# EAGLE design LT1054_Bipolar5V (EAGLE 9.6.2)
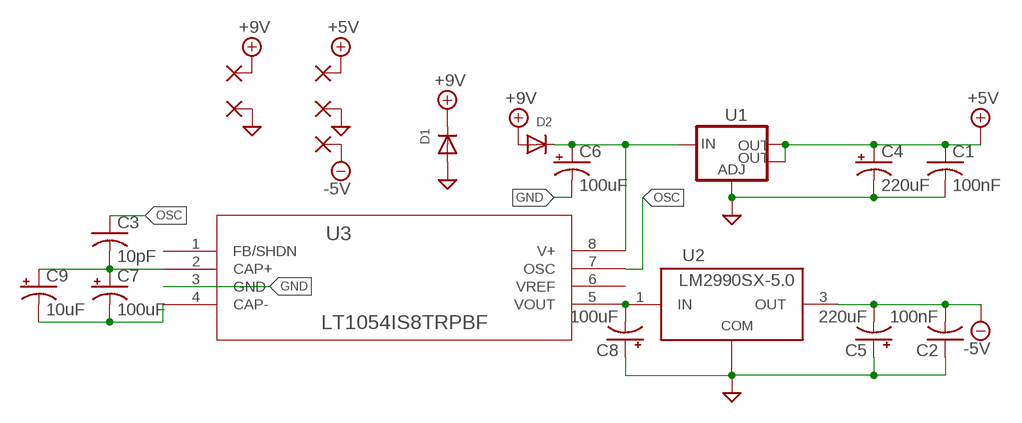
[diagram p0: schematic, sheet 1]

## Parts
C1  100nF  C-USC0603  [C0603]
C2  100nF  C-USC0603  [C0603]
C3  10pF  C-USC0603  [C0603]
C4  220uF  CPOL-USE  [PANASONIC_E]
C5  220uF  CPOL-USE  [PANASONIC_E]
C6  100uF  CPOL-USD  [PANASONIC_D]
C7  100uF  CPOL-USD  [PANASONIC_D]
C8  100uF  CPOL-USD  [PANASONIC_D]
C9  10uF  CPOL-USB  [PANASONIC_B]
D1  DIODESOD-123  [SOD-123]
D2  DIODESOD-123  [SOD-123]
PAD1  SMD2  [SMD1,27-2,54]
PAD2  1,6/0,8  [1,6/0,8]
PAD3  1,6/0,8  [1,6/0,8]
PAD4  1,6/0,8  [1,6/0,8]
PAD5  1,6/0,8  [1,6/0,8]
U1  V_REG_LM1117SOT223  [SOT223]
U2  LM2990SX-5.0  UA7805CKTTR  [D2PAK-3]
U3  LT1054IS8TRPBF  [SO-8_S]

## Nets
+5V: C1.1 C4.+ PAD3.1(P) U1.2(OUT) U1.4(OUT)
+9V: D1.C D2.A PAD1.1(P)
-5V: C2.2 C5.- PAD5.1(P) U2.3(OUT)
GND: C1.2 C2.1 C4.- C5.+ C6.- C8.+ D1.A PAD2.1(P) PAD4.1(P) U1.1(ADJ) U2.2(COM) U2.4(COM) U3.3(GND)
N$1: C6.+ D2.C U1.3(IN) U3.8(V+)
N$2: C8.- U2.1(IN) U3.5(VOUT)
N$3: C3.2 C7.+ C9.+ U3.2(CAP+)
N$4: C7.- C9.- U3.4(CAP-)
OSC: C3.1 U3.7(OSC)
Unconnected: U3.1(FB/SHDN)

## Power pins joined to a net without a drawn wire
VREF: U3.6(VREF)

## Library data of the parts
C1-C3 = adafruit:C-US: CAPACITOR, American symbol
C4-C9 = adafruit:CPOL-US: POLARIZED CAPACITOR, American symbol
D1 D2 = adafruit:DIODE: Diode SMADIODE - SMA Surface Mount Package 20V 1A Schottky Diode Digikey: 641-1014-6-ND DO-1N4148 - Through Hole Small Current Diode SOD-123 20V 1 A (.5mV Vf) Schottky Diode - Digikey: MBRX120TPMSCT-ND SOD-323 10V 570mA (.38mV Vf, 3ns) Schottky Diode - Digikey: ZLLS410CT-ND SOD-523 30V 30mA Schottky Diode (RB751S-40TE61) - Digikey: RB751S-40TE61CT-ND SOT23-R/W - SOT23 Package (R = Solder Paste/Reflow Ovens, W = Hand-Soldering) BAT54Film 40V 300mA - Digikey: 497-7162-1-ND
PAD1 = wirepad:SMD2: SMD PAD
PAD2-PAD5 = wirepad:1,6/0,8: THROUGH-HOLE PAD
U1 = SparkFun-IC-Power:V_REG_LM1117: Voltage Regulator LM1117 Standard adjustable voltage regulator but in SMD form. Spark Fun Electronics SKU : COM-00595; PROD_ID: VREG-08170
U2 = IC:UA7805CKTTR: IC REG LIN 5V 1.5A DDPAK/TO263-3 Manufacturer's datasheet <http://www.ti.com/general/docs/suppproductinfo.tsp?distId=10&gotoUrl=http%3A%2F%2Fwww.ti.com%2Flit%2Fgpn%2Fua78>; CREATED_BY: PCBLayout.com; DIGIKEY_PART_NUMBER: 296-20796-2-ND; MANUFACTURER: Texas Instruments; MPN: UA7805CKTTR; PACKAGE: DDPAK/TO-263-3
U3 = LT1054IS8TRPBF:LT1054IS8TRPBF: Check prices <https://pricing.snapeda.com/search/part/LT1054IS8%23TRPBF/?ref=eda>; AVAILABILITY: Warning; DESCRIPTION: Charge Pump INV/STPUP 100mA 8-Pin SOIC N T/R; MF: Analog Devices; MP: LT1054IS8#TRPBF; PACKAGE: SOIC -8 Analog Devices; PRICE: None; PURCHASE-URL: https://pricing.snapeda.com/search/part/LT1054IS8#TRPBF/?ref=eda

## Board
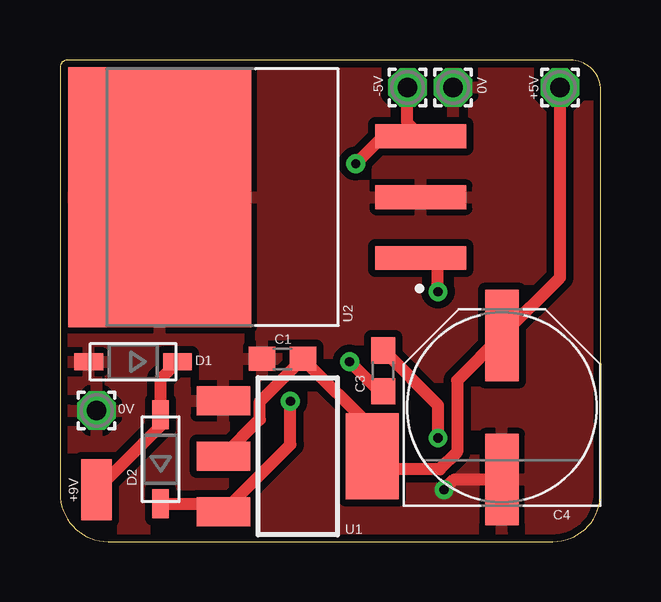
[diagram p1: board, top side]
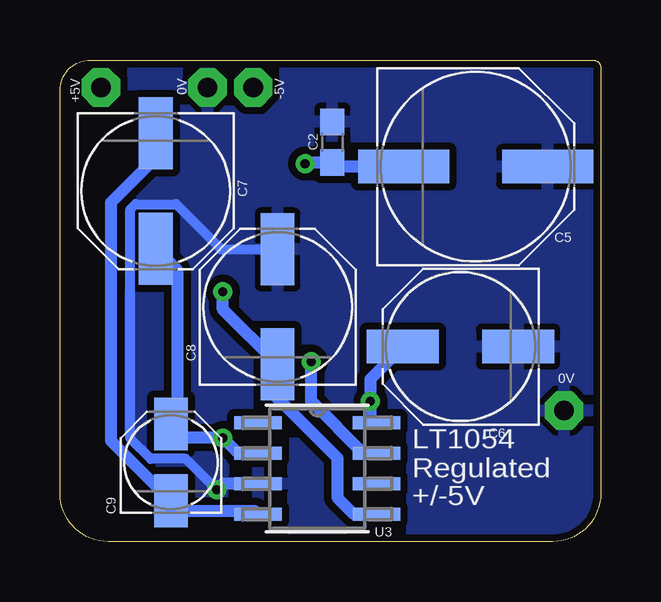
[diagram p2: board, bottom side, seen from below]

Size 22.53 x 20.07 mm. Coordinates in mm from the lower left corner, seen from the top.
Outline: 0,19.75 0,2 arc90 2,0 20.53,0 arc90 22.53,2 22.53,18.8 arc90 21.26,20.07 0.32,20.07 arc90 0,19.75
Copper layers (1*16): Top 0.035mm / dielectric 1.5mm / Bottom 0.035mm
Design rules "default *": minimum track width 6mil, minimum drill 0.35mm, track to track 6mil, track to pad 6mil, pad to pad 6mil, via to via 6mil, smd to smd 6mil, copper to edge 10mil, drill to drill 6mil, minimum pad ring 10mil, minimum via ring 8mil, stop-mask expansion 4mil, vias tented up to drill 0mil, thermal gap 10mil

### Footprints (pad centres in the part's own frame; a part is rotated, then mirrored left to right if it is on the bottom)
C0603 = smd 1.1 x 1: 1 -0.85,0; 2 0.85,0
PANASONIC_E = smd 3.8 x 1.4: + 3,0; - -3,0
PANASONIC_D = smd 3 x 1.4: + 2.4,0; - -2.4,0
PANASONIC_B = smd 2.2 x 1.4: + 1.6,0; - -1.6,0
SOD-123 = smd 1.2 x 0.7: A 1.85,0; C -1.85,0
SMD1,27-2,54 = smd 1.27 x 2.54: 1 0,0
1,6/0,8 = drill 0.813 pad 1.6 octagon: 1 0,0
SOT223 = smd 1.219 x 2.235: 1 -2.311,-3.099; 2 0,-3.099; 3 2.311,-3.099 | smd 3.6 x 2.2: 4 0,3.099
D2PAK-3 = smd 0.99 x 3.79: 1 -2.54,-6.4; 2 0,-6.4; 3 2.54,-6.4 | smd 10.84 x 7.62: 4 0,4.48
SO-8_S = smd 1.981 x 0.533: 1 -2.464,1.905; 2 -2.464,0.635; 3 -2.464,-0.635; 4 -2.464,-1.905; 5 2.464,-1.905; 6 2.464,-0.635; 7 2.464,0.635; 8 2.464,1.905

### Placement (x,y rotation side)
C1  9.27,7.62 180 top
C2  11.18,16.64 270 bottom
C3  13.46,7.11 90 top
C4  18.41,5.59 90 top
C5  5.21,15.62 0 bottom
C6  5.84,8.13 180 bottom
C7  18.54,14.61 270 bottom
C8  13.46,9.78 90 bottom
C9  17.91,3.3 90 bottom
D1  3.05,7.49 180 top
D2  4.19,3.43 90 top
PAD1  1.52,2.16 0 top
PAD2  1.52,5.46 0 top
PAD3  20.83,18.92 0 top
PAD4  16.38,18.92 0 top
PAD5  14.48,18.92 0 top
U1  9.91,3.56 270 top
U2  8.64,14.35 90 top
U3  11.81,3.05 0 bottom

### Tracks (layer width: path | path; a pad name or v marks a point on that pad's centre or on a via)
+5V
  Top 0.508: U1.2 8.33,5.09 8.33,5.83 C1.1 13.01,4.74 U1.4 13.01,2.62 13.08,2.54 13.55,3.01 15.82,3.01 16.55,3.73 16.55,6.72 C4.+ 20.83,11 PAD3.1
+9V
  Top 0.508: PAD1.1 4.19,4.83 D2.A 4.19,6.79 D1.C
-5V  (via drill 0.38)
  Top 0.508: v12.32,15.75 13.46,16.89 U2.3 14.48,17.45 PAD5.1
  Bottom 0.508: C5.- 11.01,15.62 C2.2 12.28,15.79 v12.32,15.75
GND  (via drill 0.38)
  Top 0.508: v16,2.16 16.43,2.59 C4.-
  Bottom 0.406: v16,2.16 17.29,3.45 18.75,3.45 19.6,4.29 19.6,13.85 19.39,14.06 17.7,14.06 15.81,12.18 C8.+
  Bottom 0.508: U3.3 15.75,2.41 v16,2.16
  pour Bottom (isolate 0.305): -1.27,21.59 -1.27,-1.27 24.13,-1.27 24.13,21.59
  pour Top (isolate 0.305): -1.27,21.59 -1.27,-1.27 24.13,-1.27 24.13,21.59
N$1  (via drill 0.38)
  Top 0.508: D2.C 6.47,1.58 U1.3 9.6,4.04 v9.6,5.84
  Bottom 0.508: C6.+ 9.6,6.77 v9.6,5.84 9.6,5.21 U3.8
N$2  (via drill 0.38)
  Top 0.508: v15.75,10.41 15.75,11.56 15.88,11.68 15.75,11.81 U2.1
  Bottom 0.508: U3.5 10.29,1.14 10.97,1.83 10.97,3.48 13.46,5.97 C8.- 15.75,9.66 v15.75,10.41
N$3  (via drill 0.38)
  Top 0.508: C3.2 15.75,5.68 v15.75,4.32
  Bottom 0.508: U3.2 15.11,3.68 v15.75,4.32 17.32,4.32 C9.+ 17.65,5.16 17.65,11.32 C7.+
N$4
  Bottom 0.508: U3.4 14.4,1.27 17.78,1.27 17.91,1.4 C9.- 20.41,4.21 20.41,14.13 18.54,16 C7.-
OSC  (via drill 0.38)
  Top 0.508: v12.06,7.49 13.3,6.26 C3.1
  Bottom 0.508: U3.7 9.91,3.68 12.06,5.84 v12.06,7.49

### Text on the board
tPlace: -5V | 0V | +5V | 0V | +9V
bPlace: -5V | 0V | +5V | 0V | LT1054 / Regulated | +/-5V